# Altium schematic sheet Screen.SchDoc: =ProjectName
size A4; CheckedBy: DatNB; Author: Ven; CompanyName: Nacentech; Organization: IMET
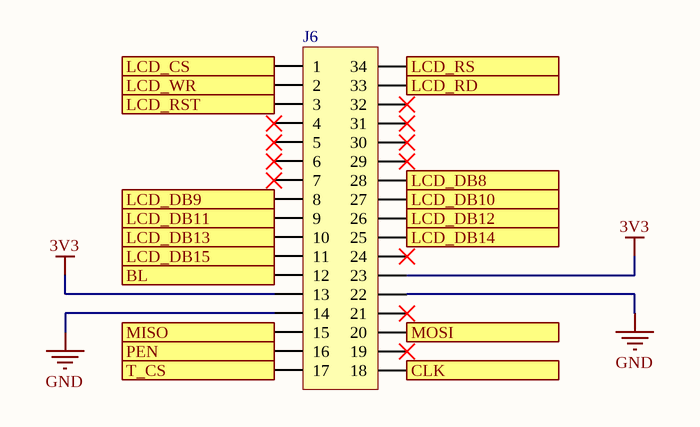
[diagram p0: Screen.SchDoc]

## Parts
J6  JP17x2  [JP17-C2T]  (value not drawn)

## Ports
BL (in), CLK (in), LCD_CS (in), LCD_DB8 (in), LCD_DB9 (in), LCD_DB10 (in), LCD_DB11 (in), LCD_DB12 (in), LCD_DB13 (in), LCD_DB14 (in), LCD_DB15 (in), LCD_RD (in), LCD_RS (in), LCD_RST (in), LCD_WR (in), MISO (out), MOSI (in), PEN (out), T_CS (in)

## Nets
3V3: J6.13 J6.23
GND: J6.14 J6.22
BL: J6.12 ; port BL
CLK: J6.18 ; port CLK
LCD_CS: J6.1 ; port LCD_CS
LCD_DB8: J6.28 ; port LCD_DB8
LCD_DB9: J6.8 ; port LCD_DB9
LCD_DB10: J6.27 ; port LCD_DB10
LCD_DB11: J6.9 ; port LCD_DB11
LCD_DB12: J6.26 ; port LCD_DB12
LCD_DB13: J6.10 ; port LCD_DB13
LCD_DB14: J6.25 ; port LCD_DB14
LCD_DB15: J6.11 ; port LCD_DB15
LCD_RD: J6.33 ; port LCD_RD
LCD_RS: J6.34 ; port LCD_RS
LCD_RST: J6.3 ; port LCD_RST
LCD_WR: J6.2 ; port LCD_WR
MISO: J6.15 ; port MISO
MOSI: J6.20 ; port MOSI
PEN: J6.16 ; port PEN
T_CS: J6.17 ; port T_CS

Not connected (* = marked no-connect by the designer): J6 4* 5* 6* 7* 19* 21* 24* 29* 30* 31* 32*

## Notes on the sheet
- Project:
- Page Contents:
- Size:
- Date:
- A4
- Checked by:
- Time:
- Revision:
- Sheet
- of
- File:

## Library data of the parts
J6 = JP17x2: WR-PHD 2.54 mm Dual Socket Header; Manufacturer: W¨¹rth Elektronik eiSos GmbH; partNo: 61303421821; ComponentLink1 Description: Manufacturer; ComponentLink2 Description: Datasheet; NoPins: 34; Created Date: 29 March 2013; ComponentLink1URL: http://www.we-online.com; ComponentLink2URL: http://katalog.we-online.de/em/datasheet/6130xx21821.pdf; Created by: Karrer Zheng